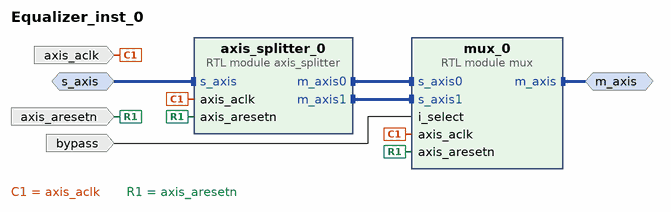
[diagram p0: block diagram of the top level]
# Vivado block design Equalizer_inst_0, xczu28dr-ffvg1517-2-e, Vivado 2022.1
create_bd_design Equalizer_inst_0

create_bd_intf_port -mode Master -vlnv xilinx.com:interface:axis_rtl:1.0 m_axis
create_bd_intf_port -mode Slave -vlnv xilinx.com:interface:axis_rtl:1.0 s_axis
create_bd_port -dir I -type clk axis_aclk
create_bd_port -dir I -type rst axis_aresetn
create_bd_port -dir I bypass

create_bd_cell -type module -reference axis_splitter axis_splitter_0
create_bd_cell -type module -reference mux mux_0

# ---- connections ----

connect_bd_intf_net [get_bd_intf_pins axis_splitter_0/m_axis0] [get_bd_intf_pins mux_0/s_axis0]
connect_bd_intf_net [get_bd_intf_pins axis_splitter_0/m_axis1] [get_bd_intf_pins mux_0/s_axis1]
connect_bd_intf_net [get_bd_intf_ports m_axis] [get_bd_intf_pins mux_0/m_axis]
connect_bd_intf_net -intf_net s_axis_0_1 [get_bd_intf_ports s_axis] [get_bd_intf_pins axis_splitter_0/s_axis]
connect_bd_net -net aclk_0_1 [get_bd_ports axis_aclk] [get_bd_pins axis_splitter_0/axis_aclk] [get_bd_pins mux_0/axis_aclk]
connect_bd_net -net aresetn_0_1 [get_bd_ports axis_aresetn] [get_bd_pins axis_splitter_0/axis_aresetn] [get_bd_pins mux_0/axis_aresetn]
connect_bd_net -net i_select_0_1 [get_bd_ports bypass] [get_bd_pins mux_0/i_select]

validate_bd_design
save_bd_design
